# Altium schematic sheet microcontroller.SchDoc: Microcontroller
size A3; SheetNumber: 1; SheetTotal: 7
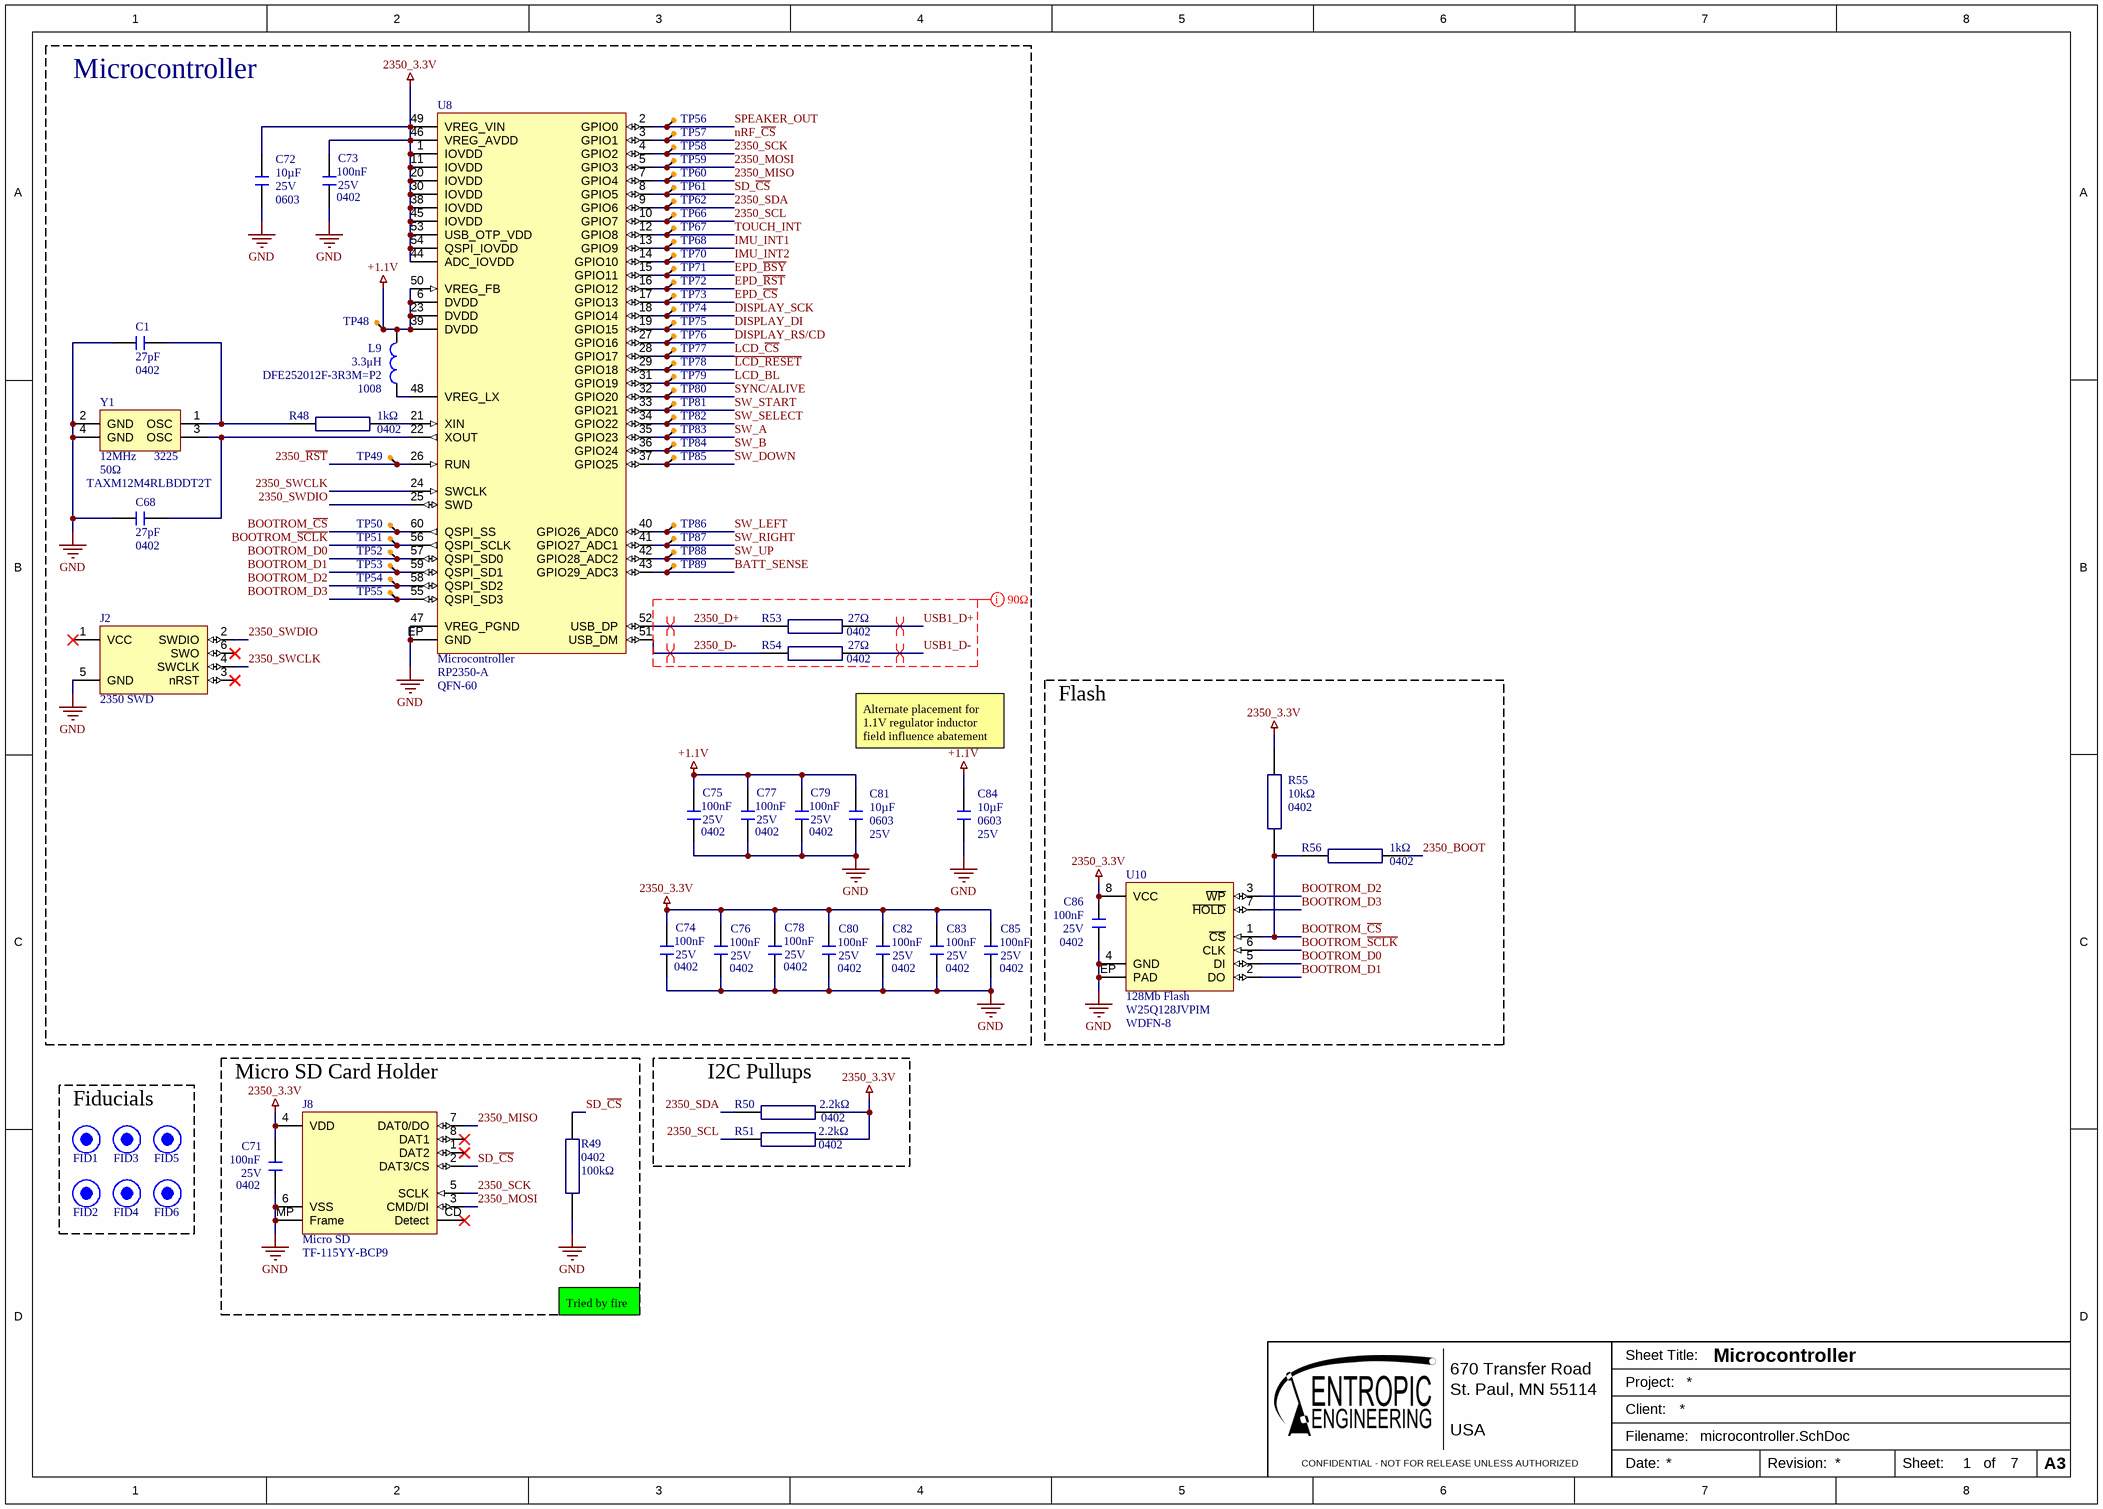
[diagram p0: microcontroller.SchDoc]

## Parts
C1  value 27pF  Case/Package: 0402  [0402_capacitor]  (hidden comment: CC0402JRNPO9BN270)
C68  value 27pF  Case/Package: 0402  [0402_capacitor]  (hidden comment: CC0402JRNPO9BN270)
C71  Case Code (Imperial): 0402  Voltage: 25V  Capacitance: 100nF  [0402_capacitor]  (hidden comment: GRM155R71E104KE14D)
C72  value 10µF  Voltage Rating: 25V  Case/Package: 0603  [0603_capacitor]  (hidden comment: CL10A106MA8NRNC)
C73  Case Code (Imperial): 0402  Voltage: 25V  Capacitance: 100nF  [0402_capacitor]  (hidden comment: GRM155R71E104KE14D)
C74  Case Code (Imperial): 0402  Voltage: 25V  Capacitance: 100nF  [0402_capacitor]  (hidden comment: GRM155R71E104KE14D)
C75  Case Code (Imperial): 0402  Voltage: 25V  Capacitance: 100nF  [0402_capacitor]  (hidden comment: GRM155R71E104KE14D)
C76  Case Code (Imperial): 0402  Voltage: 25V  Capacitance: 100nF  [0402_capacitor]  (hidden comment: GRM155R71E104KE14D)
C77  Case Code (Imperial): 0402  Voltage: 25V  Capacitance: 100nF  [0402_capacitor]  (hidden comment: GRM155R71E104KE14D)
C78  Case Code (Imperial): 0402  Voltage: 25V  Capacitance: 100nF  [0402_capacitor]  (hidden comment: GRM155R71E104KE14D)
C79  Case Code (Imperial): 0402  Voltage: 25V  Capacitance: 100nF  [0402_capacitor]  (hidden comment: GRM155R71E104KE14D)
C80  Case Code (Imperial): 0402  Voltage: 25V  Capacitance: 100nF  [0402_capacitor]  (hidden comment: GRM155R71E104KE14D)
C81  value 10µF  Voltage Rating: 25V  Case/Package: 0603  [0603_capacitor]  (hidden comment: CL10A106MA8NRNC)
C82  Case Code (Imperial): 0402  Voltage: 25V  Capacitance: 100nF  [0402_capacitor]  (hidden comment: GRM155R71E104KE14D)
C83  Case Code (Imperial): 0402  Voltage: 25V  Capacitance: 100nF  [0402_capacitor]  (hidden comment: GRM155R71E104KE14D)
C84  value 10µF  Voltage Rating: 25V  Case/Package: 0603  [0603_capacitor]  (hidden comment: CL10A106MA8NRNC)
C85  Case Code (Imperial): 0402  Voltage: 25V  Capacitance: 100nF  [0402_capacitor]  (hidden comment: GRM155R71E104KE14D)
C86  Case Code (Imperial): 0402  Voltage: 25V  Capacitance: 100nF  [0402_capacitor]  (hidden comment: GRM155R71E104KE14D)
FID1  fiducial  [fiducial-0.5]  (value not drawn)  (no BOM)
FID2  fiducial  [fiducial-0.5]  (value not drawn)  (no BOM)
FID3  fiducial  [fiducial-0.5]  (value not drawn)  (no BOM)
FID4  fiducial  [fiducial-0.5]  (value not drawn)  (no BOM)
FID5  fiducial  [fiducial-0.5]  (value not drawn)  (no BOM)
FID6  fiducial  [fiducial-0.5]  (value not drawn)  (no BOM)
J2  2350 SWD  [debug_header_dual]  (no BOM)
J8  Micro SD  [TF-115YY-BCP9]
L9  value 3.3μH  Case Code (Imperial): 1008  [INDC2520X12N]  (hidden comment: DFE252012F-3R3M=P2)
R48  value 1kΩ  Case/Package: 0402  [0402_resistor]  (hidden comment: RC0402JR-071KL)
R49  value 100kΩ  Case/Package: 0402  [0402_resistor]  (hidden comment: RC0402FR-07100KL)
R50  value 2.2kΩ  Case/Package: 0402  [0402_resistor]  (hidden comment: RC0402FR-072K2L)
R51  value 2.2kΩ  Case/Package: 0402  [0402_resistor]  (hidden comment: RC0402FR-072K2L)
R53  Resistance: 27Ω  Size Code: 0402  [0402_resistor]  (hidden comment: RMCF0402FT27R0)
R54  Resistance: 27Ω  Size Code: 0402  [0402_resistor]  (hidden comment: RMCF0402FT27R0)
R55  Case Code (Imperial): 0402  Resistance: 10kΩ  [0402_resistor]  (hidden comment: RMCF0402FT10K0)
R56  value 1kΩ  Case/Package: 0402  [0402_resistor]  (hidden comment: RC0402JR-071KL)
TP48  +1.1V  [test_point-1]  (value not drawn)  (no BOM)
TP49  test_point-1  [test_point-1]  (value not drawn)  (no BOM)
TP50  test_point-1  [test_point-1]  (value not drawn)  (no BOM)
TP51  test_point-1  [test_point-1]  (value not drawn)  (no BOM)
TP52  test_point-1  [test_point-1]  (value not drawn)  (no BOM)
TP53  test_point-1  [test_point-1]  (value not drawn)  (no BOM)
TP54  test_point-1  [test_point-1]  (value not drawn)  (no BOM)
TP55  test_point-1  [test_point-1]  (value not drawn)  (no BOM)
TP56  test_point-1  [test_point-1]  (value not drawn)  (no BOM)
TP57  test_point-1  [test_point-1]  (value not drawn)  (no BOM)
TP58  test_point-1  [test_point-1]  (value not drawn)  (no BOM)
TP59  test_point-1  [test_point-1]  (value not drawn)  (no BOM)
TP60  test_point-1  [test_point-1]  (value not drawn)  (no BOM)
TP61  test_point-1  [test_point-1]  (value not drawn)  (no BOM)
TP62  test_point-1  [test_point-1]  (value not drawn)  (no BOM)
TP66  test_point-1  [test_point-1]  (value not drawn)  (no BOM)
TP67  test_point-1  [test_point-1]  (value not drawn)  (no BOM)
TP68  test_point-1  [test_point-1]  (value not drawn)  (no BOM)
TP70  test_point-1  [test_point-1]  (value not drawn)  (no BOM)
TP71  test_point-1  [test_point-1]  (value not drawn)  (no BOM)
TP72  test_point-1  [test_point-1]  (value not drawn)  (no BOM)
TP73  test_point-1  [test_point-1]  (value not drawn)  (no BOM)
TP74  test_point-1  [test_point-1]  (value not drawn)  (no BOM)
TP75  test_point-1  [test_point-1]  (value not drawn)  (no BOM)
TP76  test_point-1  [test_point-1]  (value not drawn)  (no BOM)
TP77  test_point-1  [test_point-1]  (value not drawn)  (no BOM)
TP78  test_point-1  [test_point-1]  (value not drawn)  (no BOM)
TP79  test_point-1  [test_point-1]  (value not drawn)  (no BOM)
TP80  test_point-1  [test_point-1]  (value not drawn)  (no BOM)
TP81  test_point-1  [test_point-1]  (value not drawn)  (no BOM)
TP82  test_point-1  [test_point-1]  (value not drawn)  (no BOM)
TP83  test_point-1  [test_point-1]  (value not drawn)  (no BOM)
TP84  test_point-1  [test_point-1]  (value not drawn)  (no BOM)
TP85  test_point-1  [test_point-1]  (value not drawn)  (no BOM)
TP86  test_point-1  [test_point-1]  (value not drawn)  (no BOM)
TP87  test_point-1  [test_point-1]  (value not drawn)  (no BOM)
TP88  test_point-1  [test_point-1]  (value not drawn)  (no BOM)
TP89  test_point-1  [test_point-1]  (value not drawn)  (no BOM)
U8  Microcontroller  Package: QFN-60  [PQFN40P700X700X80_HS-61N]
U10  128Mb Flash  [WDFN-8]
Y1  value 12MHz  Case/Package: 3225  ESR: 50Ω  [3225_crystal]  (hidden comment: TAXM12M4RLBDDT2T)

## Blocks framed on the sheet
Microcontroller: C1 C68 C72-C85 J2 L9 R48 R53 R54 TP48-TP62 TP66-TP68 TP70-TP89 U8 Y1
Flash: C86 R55 R56 U10
Fiducials: FID1-FID6
Micro SD Card Holder: C71 J8 R49
I2C Pullups: R50 R51

## Nets
2350_3.3V: C71.2 C72.2 C73.2 C74.2 C76.2 C78.2 C80.2 C82.2 C83.2 C85.2 C86.2 J8.4(VDD) R50.1 R51.1 R55.1 U8.1(IOVDD) U8.11(IOVDD) U8.20(IOVDD) U8.30(IOVDD) U8.38(IOVDD) U8.44(ADC_IOVDD) U8.45(IOVDD) U8.46(VREG_AVDD) U8.49(VREG_VIN) U8.53(USB_OTP_VDD) U8.54(QSPI_IOVDD) U10.8(VCC)
+1.1V: C75.2 C77.2 C79.2 C81.2 C84.2 L9.2 TP48.1 U8.6(DVDD) U8.23(DVDD) U8.39(DVDD) U8.50(VREG_FB)
GND: C1.1 C68.1 C71.1 C72.1 C73.1 C74.1 C75.1 C76.1 C77.1 C78.1 C79.1 C80.1 C81.1 C82.1 C83.1 C84.1 C85.1 C86.1 J2.5(GND) J8.6(VSS) J8.MP(Frame) R49.1 U8.47(VREG_PGND) U8.EP(GND) U10.4(GND) U10.EP(PAD) Y1.2(GND) Y1.4(GND)
2350_BOOT: R56.2
2350_D+: R53.1 U8.52(USB_DP)
2350_D-: R54.1 U8.51(USB_DM)
2350_MISO: J8.7(DAT0/DO) TP60.1 U8.7(GPIO4)
2350_MOSI: J8.3(CMD/DI) TP59.1 U8.5(GPIO3)
2350_~{RST}: TP49.1 U8.26(RUN)
2350_SCK: J8.5(SCLK) TP58.1 U8.4(GPIO2)
2350_SCL: R51.2 TP66.1 U8.10(GPIO7)
2350_SDA: R50.2 TP62.1 U8.9(GPIO6)
2350_SWCLK: J2.4(SWCLK) U8.24(SWCLK)
2350_SWDIO: J2.2(SWDIO) U8.25(SWD)
~{LCD_RESET}: TP78.1 U8.29(GPIO18)
BATT_SENSE: TP89.1 U8.43(GPIO29_ADC3)
BOOTROM_~{CS}: R55.2 R56.1 TP50.1 U8.60(QSPI_SS) U10.1(~{CS})
BOOTROM_D0: TP52.1 U8.57(QSPI_SD0) U10.5(DI)
BOOTROM_D1: TP53.1 U8.59(QSPI_SD1) U10.2(DO)
BOOTROM_D2: TP54.1 U8.58(QSPI_SD2) U10.3(~{WP})
BOOTROM_D3: TP55.1 U8.55(QSPI_SD3) U10.7(~{HOLD})
BOOTROM_~{SCLK}: TP51.1 U8.56(QSPI_SCLK) U10.6(CLK)
DISPLAY_DI: TP75.1 U8.19(GPIO15)
DISPLAY_RS/CD: TP76.1 U8.27(GPIO16)
DISPLAY_SCK: TP74.1 U8.18(GPIO14)
EPD_~{BSY}: TP71.1 U8.15(GPIO11)
EPD_~{CS}: TP73.1 U8.17(GPIO13)
EPD_~{RST}: TP72.1 U8.16(GPIO12)
IMU_INT1: TP68.1 U8.13(GPIO9)
IMU_INT2: TP70.1 U8.14(GPIO10)
LCD_BL: TP79.1 U8.31(GPIO19)
LCD_~{CS}: TP77.1 U8.28(GPIO17)
nRF_~{CS}: TP57.1 U8.3(GPIO1)
SD_~{CS}: J8.2(DAT3/CS) R49.2 TP61.1 U8.8(GPIO5)
SPEAKER_OUT: TP56.1 U8.2(GPIO0)
SW_A: TP83.1 U8.35(GPIO23)
SW_B: TP84.1 U8.36(GPIO24)
SW_DOWN: TP85.1 U8.37(GPIO25)
SW_LEFT: TP86.1 U8.40(GPIO26_ADC0)
SW_RIGHT: TP87.1 U8.41(GPIO27_ADC1)
SW_SELECT: TP82.1 U8.34(GPIO22)
SW_START: TP81.1 U8.33(GPIO21)
SW_UP: TP88.1 U8.42(GPIO28_ADC2)
SYNC/ALIVE: TP80.1 U8.32(GPIO20)
TOUCH_INT: TP67.1 U8.12(GPIO8)
USB1_D+: R53.2
USB1_D-: R54.2
NetC1_2: C1.2 R48.1 Y1.1(OSC)
NetC68_2: C68.2 U8.22(XOUT) Y1.3(OSC)
NetL9_1: L9.1 U8.48(VREG_LX)
NetR48_2: R48.2 U8.21(XIN)

Not connected (* = marked no-connect by the designer): J2 1(VCC)* 3(nRST)* 6(SWO)*; J8 1(DAT2)* 8(DAT1)* CD(Detect)*

## Layout directives
differential pair; differential pair class USB_DIFF: 2350_D+, 2350_D-, USB1_D+, USB1_D-
net class 90_OHM: 2350_D+, 2350_D-, USB1_D+, USB1_D-

## Notes on the sheet
- Alternate placement for 1.1V regulator inductor field influence abatement
- Tried by fire
- 670 Transfer Road
- St. Paul, MN 55114
- Sheet Title:
- Project:
- CONFIDENTIAL - NOT FOR RELEASE UNLESS AUTHORIZED
- USA
- Client:
- Filename:
- Date:
- Revision:
- Sheet:
- of
- A3

## Library data of the parts
C1 C68 = CC0402JRNPO9BN270: 27 pF, 25 V, X7R, 0402 Chip capacitor; Manufacturer: Yageo; house_part_number: C-27pF-0402-002; Tolerance: 5%; Voltage Rating: 50V; Dielectric: C0G; Manufacturer Part Number: CC0402JRNPO9BN270; RoHS: Yes; Category: Ceramic Capacitors; Stock: 1230000; Pricing: 10000=0.0024, 40000=0.0022, 150000=0.0021, 400000=0.002, 1000000=0.0019 (USD); Mounting Technology: Surface Mount; Pins: 2; Case Code (Metric): 1005; Case Code (Imperial): 0402; Min Operating Temperature: -55°C; Max Operating Temperature: 125°C; Package Quantity: 1; Packaging: Tape and Reel; Voltage Rating (DC): 50V; Termination: SMD/SMT; Series: CC; Length: 1mm; Width: 0.02inch; Thickness: 0.022inch; Depth: 0.5mm; Radiation Hardening: No; Reach SVHC Compliant: No; Lead Free: Lead Free; RoHS Compliant: Yes; ComponentLink1URL: https://datasheet.ciiva.com/26862/getdatasheetpartid-403452-26862597.pdf?src-supplier=Verical; ComponentLink1Description: https://datasheet.ciiva.com/26862/getdatasheetpartid-403452-26862597.pdf?src-supplier=Verical; ComponentLink2URL: https://datasheet.ciiva.com/28450/1443161-28450249.pdf?src-supplier=Element14; ComponentLink2Description: https://datasheet.ciiva.com/28450/1443161-28450249.pdf?src-supplier=Element14; ComponentLink3URL: https://datasheet.ciiva.com/176/mlccorderingcode-176355.pdf?src-supplier=Digikey; ComponentLink3Description: https://datasheet.ciiva.com/176/mlccorderingcode-176355.pdf?src-supplier=Digikey; ComponentLink4URL: https://datasheet.ciiva.com/176/mlccorderingcode-176354.pdf?src-supplier=Digikey; ComponentLink4Description: https://datasheet.ciiva.com/176/mlccorderingcode-176354.pdf?src-supplier=Digikey; ComponentLink5URL: https://datasheet.ciiva.com/176/mlccorderingcode-176356.pdf?src-supplier=Digikey; ComponentLink5Description: https://datasheet.ciiva.com/176/mlccorderingcode-176356.pdf?src-supplier=Digikey; ComponentLink6URL: https://datasheet.ciiva.com/13386/upy-gp-np0-16v-to-50v-8-13386281.pdf?src-supplier=Mouser; ComponentLink6Description: https://datasheet.ciiva.com/13386/upy-gp-np0-16v-to-50v-8-13386281.pdf?src-supplier=Mouser; Supplier Part Number 1: 9741513; Supplier 1: Future Electronics
C71 C73-C80 C82 C83 C85 C86 = GRM155R71E104KE14D: 100 nF, 25 V, X7R, 0402 Chip capacitor; Manufacturer: Murata; house_part_number: C-100nF-0402-002; Dielectric Material: Ceramic; Tolerance: 10%; Supplier 1: Digi-Key; Supplier Part Number 1: 490-10698-1-ND; RoHS: Yes; Category: Ceramic Capacitors; Pricing 1: 1=0.10000, 10=0.02700, 50=0.01460, 100=0.01190, 500=0.00848, 1000=0.00666, 2500=0.00605, 5000=0.00557 (USD); Mount: Surface Mount; Case/Package: 0402; Case Code (Metric): 1005; Weight: 0.000212oz; Min Operating Temperature: -55°C; Max Operating Temperature: 125°C; Packaging: Tape and Reel; Voltage Rating: 25V; Dielectric: X7R; Termination: SMD/SMT; Resistor Type: Ceramic; Voltage Rating (DC): 25V; Package Quantity: 10000; Length: 1mm; Width: 0.02inch; Height: 0.5mm; Thickness: 0.022inch; Depth: 0.5mm; REACH SVHC: Unknown; Lead Free: Lead Free; RoHS Compliant: Yes; ComponentLink1URL: http://www.farnell.com/datasheets/1872206.pdf?src-supplier=Farnell; ComponentLink1Description: http://www.farnell.com/datasheets/1872206.pdf?src-supplier=Farnell; ComponentLink2URL: http://components.arrow.com/part/dataview/0323_06361249?src-supplier=Arrow+Europe; ComponentLink2Description: http://components.arrow.com/part/dataview/0323_06361249?src-supplier=Arrow+Europe; ComponentLink3URL: http://uk.rs-online.com/webdocs/144c/0900766b8144c113.pdf?src-supplier=RSComponents; ComponentLink3Description: http://uk.rs-online.com/webdocs/144c/0900766b8144c113.pdf?src-supplier=RSComponents; ComponentLink4URL: http://www.farnell.com/datasheets/2048008.pdf?src-supplier=Farnell; ComponentLink4Description: http://www.farnell.com/datasheets/2048008.pdf?src-supplier=Farnell; ComponentLink5URL: http://www.mouser.com/ds/2/281/c02e-2905.pdf?src-supplier=Mouser; ComponentLink5Description: http://www.mouser.com/ds/2/281/c02e-2905.pdf?src-supplier=Mouser; ComponentLink6URL: http://www.farnell.com/datasheets/2048008.pdf?src-supplier=Newark; ComponentLink6Description: http://www.farnell.com/datasheets/2048008.pdf?src-supplier=Newark; ComponentLink7URL: https://search.murata.co.jp/Ceramy/image/img/A01X/G101/ENG/GRM155R71E104KE14-01.pdf?src-supplier=Digi-Key; ComponentLink7Description: https://search.murata.co.jp/Ceramy/image/img/A01X/G101/ENG/GRM155R71E104KE14-01.pdf?src-supplier=Digi-Key; ComponentLink8URL: http://www.farnell.com/datasheets/2048008.pdf?src-supplier=Element14; ComponentLink8Description: http://www.farnell.com/datasheets/2048008.pdf?src-supplier=Element14; ComponentLink9URL: http://psearch.en.murata.com/capacitor/product/GRM155R71E104KE14%23.pdf?src-supplier=Avnet; ComponentLink9Description: http://psearch.en.murata.com/capacitor/product/GRM155R71E104KE14%23.pdf?src-supplier=Avnet; Manufacturer Part Number: GRM155R71E104KE14D
C72 C81 C84 = CL10A106MA8NRNC: 10 µF, 25 V, X5R, 0603 Chip capacitor; Manufacturer: Samsung; house_part_number: C-10uF-0603-002; Tolerance: 20%; Material: 4241ConductorMaterial; RoHS: Yes; Category: Ceramic Capacitors; Case Code (Metric): 1608; Min Operating Temperature: -55°C; Max Operating Temperature: 85°C; Packaging: Cut Tape; RoHS Compliant: Yes; ComponentLink1URL: https://datasheet.ciiva.com/25766/cl10a106ma8nrnc-25766562.pdf?src-supplier=Digikey; ComponentLink1Description: https://datasheet.ciiva.com/25766/cl10a106ma8nrnc-25766562.pdf?src-supplier=Digikey; Manufacturer Part Number: CL10A106MA8NRNC; Case Code (Imperial): 0603; Height: 900um; Lead Free: Lead Free; Supplier Part Number 1: CL10A106MA8NRNC; Supplier 1: Arrow Electronics; Stock: 632000; Pricing: 4000=0.0511, 8000=0.046, 12000=0.0434, 28000=0.0413, 100000=0.0356 (USD); Mounting Technology: Surface Mount; Series: CL
FID1-FID6 = fiducial: 0.5mm diameter round fiducial; house_part_number: Disc-0.5
J2 = TAG_CONN_CTX: Mates with TC-2030-CTX-NL; house_part_number: type-value-case-grade
J8 = TF-115YY-BCP9: Micro SD card holder; Manufacturer: Xunpu; Supplier 1: LCSC; RoHS: No; Category: Uncategorized; Stock 1: 3100; Pricing 1: 10=0.0587, 100=0.0477, 300=0.0423, 1000=0.0382, 5000=0.035, 10000=0.0334 (USD); Supplier Part Number 1: C5374810; Manufacturer Part Number: TF-115YY-BCP9; house_part_number: TF-115YY-BCP9
L9 = DFE252012F-3R3M=P2: 3.3 μH, 1.8 A, 1008 Inductor; Manufacturer: Murata; house_part_number: L-3.3uH-1008-002; Core Material: Ferrite; Current Rating: 1.8A; Saturation Current: 2.8A; Shielding: Shielded; DC Resistance (DCR): 135mR; Test Frequency: 1MHz; Tolerance: 20%; RoHS: Yes; Category: Fixed Inductors; Stock: 8; Pricing: 1=0.1101 (USD); Mounting Technology: Surface Mount; Case/Package: 1008; Case Code (Metric): 2520; Min Operating Temperature: -40°C; Max Operating Temperature: 125°C; Packaging: Cut Tape; Series: DFE252012F; Length: 0.098inch; Width: 0.079inch; Height - Seated (Max): 0.047inch; RoHS Compliant: Yes; ComponentLink1URL: http://www.murata.com/~/media/webrenewal/products/inductor/chip/tokoproducts/wirewoundmetalalloychiptype/m_dfe252012f.ashx?src-supplier=Digikey; ComponentLink1Description: http://www.murata.com/~/media/webrenewal/products/inductor/chip/tokoproducts/wirewoundmetalalloychiptype/m_dfe252012f.ashx?src-supplier=Digikey; ComponentLink2URL: https://www.murata.com/~/media/webrenewal/products/inductor/chip/tokoproducts/wirewoundmetalalloychiptype/m_dfe252012f.ashx?src-supplier=Digikey; ComponentLink2Description: https://www.murata.com/~/media/webrenewal/products/inductor/chip/tokoproducts/wirewoundmetalalloychiptype/m_dfe252012f.ashx?src-supplier=Digikey; ComponentLink3URL: https://datasheet.octopart.com/DFE252012F-3R3M%3DP2-Murata-datasheet-150009032.pdf?src-supplier=Arrow.cn; ComponentLink3Description: https://datasheet.octopart.com/DFE252012F-3R3M%3DP2-Murata-datasheet-150009032.pdf?src-supplier=Arrow.cn; Manufacturer Part Number: DFE252012F-3R3M=P2; Supplier Part Number 1: DFE252012F-3R3M=P2; Supplier 1: Arrow Electronics
R48 R56 = RC0402JR-071KL: 1 kΩ, 0402 Chip resistor; Manufacturer: Yageo; house_part_number: R-1k-0402-1%-001; Tolerance: 5%; Temperature Coefficient: 100ppm/°C; Voltage Rating: 50V; Power Rating: 62.5mW; Max Power Dissipation: 63mW; Manufacturer Part Number: RC0402JR-071KL; RoHS: Yes; Category: Chip SMD Resistors; Min Operating Temperature: -55°C; Max Operating Temperature: 155°C; Resistor Type: Thick Film; Packaging: Cut Tape; Termination: SMD/SMT; RoHS Compliant: Yes; ComponentLink1URL: https://datasheet.ciiva.com/7983/1018594-7983558.pdf?src-supplier=Element14; ComponentLink1Description: https://datasheet.ciiva.com/7983/1018594-7983558.pdf?src-supplier=Element14; ComponentLink2URL: https://datasheet.ciiva.com/2452/pyu-r-int-thick-7-2452756.pdf?src-supplier=Digikey; ComponentLink2Description: https://datasheet.ciiva.com/2452/pyu-r-int-thick-7-2452756.pdf?src-supplier=Digikey; ComponentLink3URL: https://datasheet.ciiva.com/2452/pyu-r-int-thick-7-2452757.pdf?src-supplier=Digikey; ComponentLink3Description: https://datasheet.ciiva.com/2452/pyu-r-int-thick-7-2452757.pdf?src-supplier=Digikey; ComponentLink4URL: https://datasheet.ciiva.com/2452/pyu-r-int-thick-7-2452755.pdf?src-supplier=Digikey; ComponentLink4Description: https://datasheet.ciiva.com/2452/pyu-r-int-thick-7-2452755.pdf?src-supplier=Digikey; ComponentLink5URL: https://datasheet.ciiva.com/7850/1018594-7850170.pdf?src-supplier=Element14; ComponentLink5Description: https://datasheet.ciiva.com/7850/1018594-7850170.pdf?src-supplier=Element14; Stock: 15490862; Pricing: 1=0.1, 10=0.018, 50=0.0102, 100=0.0083, 500=0.00528, 1000=0.00444, 5000=0.00307 (USD); Case Code (Imperial): 0402; Case Code (Metric): 1005; Series: RC; Voltage Rating (AC): 50V; Package Quantity: 1; Number of Terminations: 2; Features: Moisture Resistant; Resistance Tolerance: 5%; Length: 0.039inch; Width: 0.02inch; Height: 0.016inch; Reach SVHC Compliant: No; Lead Free: 5697LeadFree; ComponentLink6URL: https://datasheet.ciiva.com/7850/1018594-7850171.pdf?src-supplier=Element14; ComponentLink6Description: https://datasheet.ciiva.com/7850/1018594-7850171.pdf?src-supplier=Element14; ComponentLink7URL: https://datasheet.ciiva.com/17081/pyu-rc0402-51-rohs-l-6-r-17081438.pdf?src-supplier=Future+Electronics; ComponentLink7Description: https://datasheet.ciiva.com/17081/pyu-rc0402-51-rohs-l-6-r-17081438.pdf?src-supplier=Future+Electronics; Supplier 1: Digikey; Supplier Part Number 1: 311-1.0KJRCT-ND
R49 = RC0402FR-07100KL: 100 kΩ, 0402 Chip resistor; Manufacturer: Yageo; house_part_number: R-100k-0402-1%-001; Tolerance: 1%; Temperature Coefficient: 100ppm/°C; Power Rating: 63mW; Voltage Rating: 50V; Manufacturer Part Number: RC0402FR-07100KL; RoHS: Yes; Category: Chip SMD Resistors; Stock: 44340000; Pricing: 10000=0.0012, 50000=0.0011, 100000=0.0011, 250000=0.001, 300000=0.001, 500000=0.001, 750000=0.001, 1500000=0.0009, 2000000=0.0009 (USD); Case Code (Metric): 1005; Case Code (Imperial): 0402; Min Operating Temperature: -55°C; Max Operating Temperature: 155°C; Packaging: Tape and Reel; Package Quantity: 1; Number of Terminations: 2; Termination: SMD/SMT; Max Power Dissipation: 63mW; Features: Moisture Resistant; Series: RC; Construction: Rectangular; Length: 0.039inch; Width: 0.02inch; Height: 0.016inch; Depth: 0.5mm; Military Standard: Not; RoHS Compliant: Yes; ComponentLink1URL: https://datasheet.ciiva.com/11819/0900766b80c66297-11819452.pdf?src-supplier=Rs; ComponentLink1Description: https://datasheet.ciiva.com/11819/0900766b80c66297-11819452.pdf?src-supplier=Rs; ComponentLink2URL: https://datasheet.ciiva.com/22747/1018594-22747509.pdf?src-supplier=Element14; ComponentLink2Description: https://datasheet.ciiva.com/22747/1018594-22747509.pdf?src-supplier=Element14; ComponentLink3URL: https://datasheet.ciiva.com/2453/pyu-r-int-thick-7-2453362.pdf?src-supplier=Digikey; ComponentLink3Description: https://datasheet.ciiva.com/2453/pyu-r-int-thick-7-2453362.pdf?src-supplier=Digikey; ComponentLink4URL: https://datasheet.ciiva.com/12667/pyu-rc0402-51-rohs-l-6-r-12667930.pdf?src-supplier=Mouser; ComponentLink4Description: https://datasheet.ciiva.com/12667/pyu-rc0402-51-rohs-l-6-r-12667930.pdf?src-supplier=Mouser; Supplier 1: Future Electronics; Supplier Part Number 1: 6468466; Resistor Type: Thick Film; Resistance Tolerance: 1%; Technology: THICK FILM; Voltage Rating (AC): 50V; Reach SVHC Compliant: No; Lead Free: 5697LeadFree; ComponentLink5URL: https://datasheet.ciiva.com/15189/getdatasheetpartid-323696-15189334.pdf?src-supplier=Verical; ComponentLink5Description: https://datasheet.ciiva.com/15189/getdatasheetpartid-323696-15189334.pdf?src-supplier=Verical; ComponentLink6URL: https://datasheet.ciiva.com/2453/pyu-r-int-thick-7-2453363.pdf?src-supplier=Digikey; ComponentLink6Description: https://datasheet.ciiva.com/2453/pyu-r-int-thick-7-2453363.pdf?src-supplier=Digikey; ComponentLink7URL: https://datasheet.ciiva.com/2453/pyu-r-int-thick-7-2453361.pdf?src-supplier=Digikey; ComponentLink7Description: https://datasheet.ciiva.com/2453/pyu-r-int-thick-7-2453361.pdf?src-supplier=Digikey
R50 R51 = RC0402FR-072K2L: 2.2 kΩ, 0402 Chip resistor; Manufacturer: Yageo; house_part_number: R-2.2k-0402-1%-001; Tolerance: 1%; Power Rating: 62.5mW; Voltage Rating: 50V; Temperature Coefficient: 100ppm/°C; Max Power Dissipation: 63mW; Manufacturer Part Number: RC0402FR-072K2L; RoHS: Yes; Category: Chip SMD Resistors; Stock: 4866; Pricing: 1=0.1, 20=0.0673, 150=0.0454, 1000=0.0247, 5000=0.0072 (USD); Case Code (Imperial): 0402; Case Code (Metric): 1005; Weight: 2.3E-05oz; Min Operating Temperature: -55°C; Max Operating Temperature: 155°C; Resistor Type: Thick Film; Packaging: Tape and Reel; Termination: SMD/SMT; Features: Moisture Resistant; Series: RC; Number of Terminations: 2; Resistance Tolerance: 1%; Construction: Rectangular; Technology: THICK FILM; Voltage Rating (AC): 50V; Length: 1mm; Width: 0.5mm; Height: 0.35mm; Depth: 0.5mm; RoHS Compliant: Yes; Reach SVHC Compliant: No; Military Standard: Not; Lead Free: Lead Free; ComponentLink1URL: https://datasheet.ciiva.com/11808/0900766b80c66297-11808786.pdf?src-supplier=Rs; ComponentLink1Description: https://datasheet.ciiva.com/11808/0900766b80c66297-11808786.pdf?src-supplier=Rs; ComponentLink2URL: https://datasheet.ciiva.com/7983/1018594-7983515.pdf?src-supplier=Element14; ComponentLink2Description: https://datasheet.ciiva.com/7983/1018594-7983515.pdf?src-supplier=Element14; ComponentLink3URL: https://datasheet.ciiva.com/12577/pyu-rc0402-51-rohs-l-6-r-12577429.pdf?src-supplier=Mouser; ComponentLink3Description: https://datasheet.ciiva.com/12577/pyu-rc0402-51-rohs-l-6-r-12577429.pdf?src-supplier=Mouser; ComponentLink4URL: https://datasheet.ciiva.com/46383/1018594-46383563.pdf?src-supplier=Element14; ComponentLink4Description: https://datasheet.ciiva.com/46383/1018594-46383563.pdf?src-supplier=Element14; ComponentLink5URL: https://datasheet.ciiva.com/7849/1018594-7849929.pdf?src-supplier=Element14; ComponentLink5Description: https://datasheet.ciiva.com/7849/1018594-7849929.pdf?src-supplier=Element14; ComponentLink6URL: https://datasheet.ciiva.com/7849/1018594-7849928.pdf?src-supplier=Element14; ComponentLink6Description: https://datasheet.ciiva.com/7849/1018594-7849928.pdf?src-supplier=Element14; ComponentLink7URL: https://datasheet.ciiva.com/16741/pyu-rc0402-51-rohs-l-6-r-16741015.pdf?src-supplier=Future+Electronics; ComponentLink7Description: https://datasheet.ciiva.com/16741/pyu-rc0402-51-rohs-l-6-r-16741015.pdf?src-supplier=Future+Electronics; Supplier 1: Future Electronics; Supplier Part Number 1: 9737263
R53 R54 = RMCF0402FT27R0: 27 Ω, 0402 Chip resistor; Manufacturer: Stackpole Electronics; house_part_number: R-27-0402-1%-001; Tolerance: 1%; Rated Power Dissipation (P): 63mW; Rated Temperature: 70°C; Temperature Coefficient: 100ppm/°C; Working Voltage: 50V; Package Height: 0.3mm; Package Length: 1mm; Package Width: 0.5mm; Reference Standard: AEC-Q200; Supplier 1: Digi-Key; Supplier Part Number 1: RMCF0402FT27R0CT-ND; RoHS: Yes; Category: Chip SMD Resistors; Stock 1: 3710; Pricing 1: 1=0.10000, 10=0.01500, 100=0.00610, 1000=0.00274, 2500=0.00238, 5000=0.00197 (USD); Mount: Surface Mount; Number of Pins: 2; Package Shape: Rectangular; Terminal Finish: Nickel; Min Operating Temperature: -55°C; Max Operating Temperature: 155°C; JESD-609 Code: e3; Resistor Type: FIXED RESISTOR; Construction: Rectangular; Package Style: SMTMeter; Packaging: Tape and Reel; Technology: METAL GLAZE/THICK FILM; Termination: Wraparound; REACH SVHC: Yes; RoHS Compliant: Yes; ComponentLink1URL: https://datasheet.ciiva.com:443/pdfs/VipMasterIC/IC/SEIE/SEIE-S-A0009541969/SEIE-S-A0009541969-1.pdf?src-supplier=IHS+Markit; ComponentLink1Description: https://datasheet.ciiva.com:443/pdfs/VipMasterIC/IC/SEIE/SEIE-S-A0009541969/SEIE-S-A0009541969-1.pdf?src-supplier=IHS+Markit; ComponentLink2URL: https://www.seielect.com/catalog/SEI-RMCF_RMCP.pdf?src-supplier=Avnet; ComponentLink2Description: https://www.seielect.com/catalog/SEI-RMCF_RMCP.pdf?src-supplier=Avnet; ComponentLink3URL: https://www.seielect.com/catalog/sei-rmcf_rmcp.pdf?src-supplier=Digi-Key; ComponentLink3Description: https://www.seielect.com/catalog/sei-rmcf_rmcp.pdf?src-supplier=Digi-Key; ComponentLink4URL: http://www.seielect.com/Catalog/SEI-RMCF_RMCP.pdf?src-supplier=Digi-Key; ComponentLink4Description: http://www.seielect.com/Catalog/SEI-RMCF_RMCP.pdf?src-supplier=Digi-Key; Manufacturer Part Number: RMCF0402FT27R0
R55 = RMCF0402FT10K0: 10 kΩ, 0402 Chip resistor; Manufacturer: Stackpole Electronics; house_part_number: R-10k-0402-1%-001; Tolerance: 1%; Power Rating: 62.5mW; Temperature Coefficient: 100ppm/°C; Max Power Dissipation: 63mW; Manufacturer Part Number: RMCF0402FT10K0; RoHS: Yes; Category: Chip SMD Resistors; Case/Package: 0402; Case Code (Metric): 1005; Min Operating Temperature: -55°C; Max Operating Temperature: 155°C; Packaging: Tape and Reel; Resistor Type: Thick Film; Number of Terminations: 2; Features: Automotive AEC-Q200; Series: RMCF; Construction: Rectangular; Length: 1mm; Width: 0.02inch; Depth: 0.5mm; Military Standard: Not; Lead Free: Lead Free; RoHS Compliant: Yes; ComponentLink1URL: https://datasheet.ciiva.com/24341/sei-rmcp-24341800.pdf?src-supplier=Onlinecomponents.com; ComponentLink1Description: https://datasheet.ciiva.com/24341/sei-rmcp-24341800.pdf?src-supplier=Onlinecomponents.com; Supplier 1: Digi-Key; Supplier Part Number 1: RMCF0402FT10K0CT-ND; Stock 1: 7219214; Pricing 1: 1=0.10000, 10=0.01300, 100=0.00530, 1000=0.00239, 2500=0.00207, 5000=0.00171 (USD); Mount: Surface Mount; Contact Plating: Tin,Matte; Size Code: 0402; Height: 0.016inch; Radiation Hardening: No
TP48-TP62 TP66-TP68 TP70-TP89 = test_point-1: Test point; pickable: no
U8 = RP2350-A: Microcontroller, QFN-60; Manufacturer: Raspberry Pi; Case/Package: QFN60; Manufacturer Part Number: RP2350-A; house_part_number: RP2350-A
U10 = W25Q128JVPIM: 128Mb SPI flash memory; Manufacturer: Winbond; Memory Format: Non-Volatile,FLASH; Frequency: 133MHz; Supplier: Digikey; Supplier Part Number: W25Q128JVPIM-ND; RoHS: Yes; Category: Flash; Pricing: 1=1.86, 10=1.328, 25=1.1948, 50=1.115, 100=1.049, 300=0.9675, 500=0.95002 (USD); Mounting Technology: Surface Mount; Min Operating Temperature: -40°C; Max Operating Temperature: 85°C; Packaging: Rail/Tube; Memory Size: 128Mb; Series: SpiFlash®; RoHS Compliant: Yes; ComponentLink1URL: http://www.winbond.com/resource-files/w25q128jv%20revf%2003272018%20plus.pdf?src-supplier=Digikey; ComponentLink1Description: http://www.winbond.com/resource-files/w25q128jv%20revf%2003272018%20plus.pdf?src-supplier=Digikey; ComponentLink2URL: https://datasheet.octopart.com/W25Q128JVPIQ-Winbond-datasheet-151870813.pdf?src-supplier=TECHDesign; ComponentLink2Description: https://datasheet.octopart.com/W25Q128JVPIQ-Winbond-datasheet-151870813.pdf?src-supplier=TECHDesign; Case/Package: WDFN-8; Manufacturer Part Number: W25Q128JVPIM
Y1 = TAXM12M4RLBDDT2T: 12 MHz, 10 ppm, 20 pF, 3225 Crystal; Supplier 1: LCSC; Supplier Part Number 1: C133334; Manufacturer Part Number: TAXM12M4RLBDDT2T; house_part_number: TAXM12M4RLBDDT2T